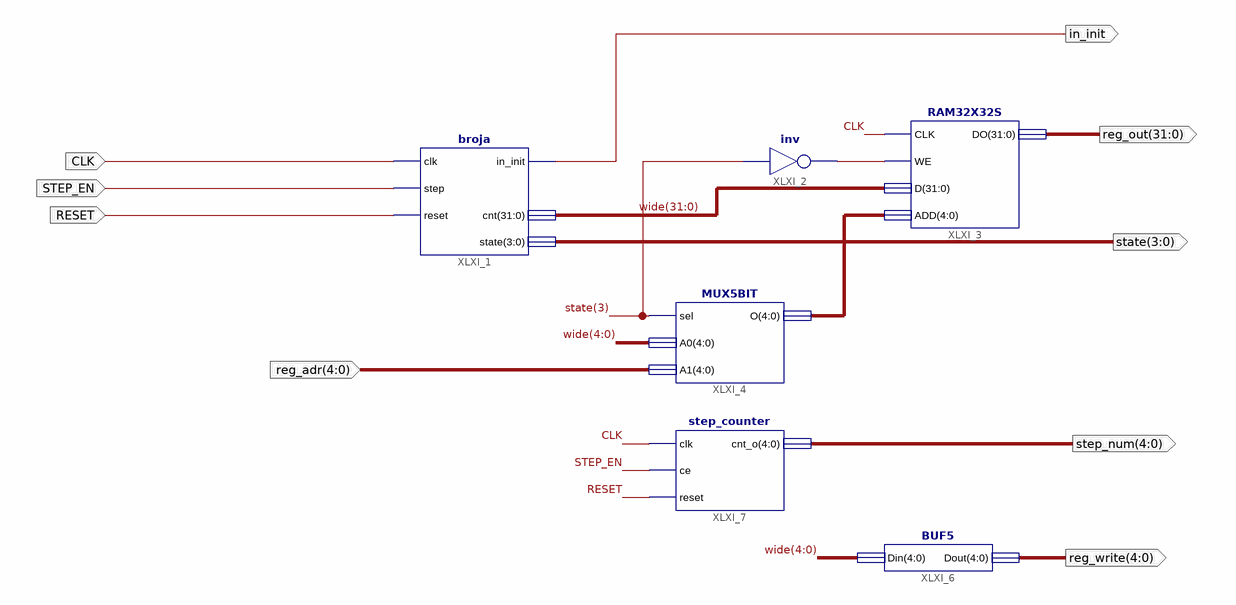
[diagram p0: schematic sheet 1]
// Xilinx ISE schematic master.sch (spartan6) as structural Verilog: 6 symbols, 9 ports
module master (
  input  STEP_EN,
  input  RESET,
  input  CLK,
  input  [4:0] reg_adr,
  output [31:0] reg_out,
  output in_init,
  output [4:0] step_num,
  output [3:0] state,
  output [4:0] reg_write
);

  wire XLXN_9;
  wire [4:0] Data;
  wire [31:0] wide;

  MUX5BIT XLXI_4 (.sel(state[3]), .A0(wide[4:0]), .A1(reg_adr), .O(Data));
  RAM32X32S XLXI_3 (.CLK(CLK), .WE(XLXN_9), .D(wide), .ADD(Data), .DO(reg_out));
  not XLXI_2 (XLXN_9, state[3]);
  broja XLXI_1 (.clk(CLK), .step(STEP_EN), .reset(RESET), .in_init(in_init), .cnt(wide), .state(state));
  BUF5 XLXI_6 (.Din(wide[4:0]), .Dout(reg_write));
  step_counter XLXI_7 (.clk(CLK), .ce(STEP_EN), .reset(RESET), .cnt_o(step_num));
endmodule
